# EAGLE schematic dc-driver (EAGLE 6.6.0)
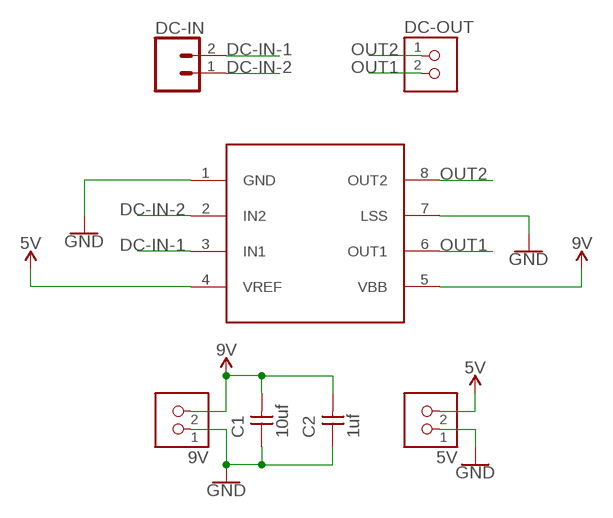
[diagram p0: schematic, sheet 1]

## Parts
5V  TERM-1X02-FABLAB  [ED555DS-2DS]
9V  TERM-1X02-FABLAB  [ED555DS-2DS]
C1  10uf  CAP-UNPOLARIZEDFAB  [C1206FAB]
C2  1uf  CAP-UNPOLARIZEDFAB  [C1206FAB]
DC-IN  CONN_021X02_NO_SILK  [1X02_NO_SILK]
DC-OUT  TERM-1X02-FABLAB  [ED555DS-2DS]
U$1  A4953  A4953-H-BRIDGE-MOTOR-DRIVER  [SOIC8]

## Nets
DC-IN-1: DC-IN.2 U$1.3(IN1)
DC-IN-2: DC-IN.1 U$1.2(IN2)
GND: 5V.1 9V.1 C1.1 C2.1 U$1.1(GND) U$1.7(LSS)
OUT1: DC-OUT.2 U$1.6(OUT1)
OUT2: DC-OUT.1 U$1.8(OUT2)
VCC: 5V.2 U$1.4(VREF) ; supply symbol labelled 5V
VDD: 9V.2 C1.2 C2.2 U$1.5(VBB) ; supply symbol labelled 9V

## Library data of the parts
5V 9V DC-OUT = fab:TERM-1X02: 3.5mm terminal block, 2 positions ED555-2DS as found in the fablab inventory. Stolen from Adafruit <http://www.ladyada.net/library/pcb/eaglelibrary.html>, adapted by Zaerc.
C1 C2 = fab:CAP-UNPOLARIZED
DC-IN = SparkFun-Connectors:CONN_02: Multi connection point. Often used as Generic Header-pin footprint for 0.1 inch spaced/style header connections On any of the 0.1 inch spaced packages, you can populate with these: Break Away Headers - Straight <https://www.sparkfun.com/products/116> (PRT-00116) Break Away Male Headers - Right Angle <https://www.sparkfun.com/products/553> (PRT-00553) Female Headers <https://www.sparkfun.com/products/115> (PRT-00115) Break Away Headers - Machine Pin <https://www.sparkfun.com/products/117> (PRT-00117) Break Away Female Headers - Swiss Machine Pin <https://www.sparkfun.com/products/743> (PRT-00743) For SCREWTERMINALS and SPRING TERMINALS visit here: Screw Terimnals on SparkFun.com <https://www.sparkfun.com/search/results?term=Screw+Terminals> (5mm/3.5mm/2.54mm spacing) This device is also useful as a general connection point to wire up your design to another part of your project. Our various solder wires solder well into these plated through hole pads. Hook-Up Wire - Assortment (Stranded, 22 AWG) <https://www.sparkfun.com/products/11375> (PRT-11375) Hook-Up Wire - Assortment (Solid Core, 22 AWG) <https://www.sparkfun.com/products/11367> (PRT-11367) View the entire wire category on our website here <https://www.sparkfun.com/categories/141> Special notes: Molex polarized connector foot print use with: PRT-08233 with associated crimp pins and housings. 2.54_SCREWTERM for use with PRT-10571. 3.5mm Screw Terminal footprints for PRT-08084 5mm Screw Terminal footprints for use with PRT-08432
U$1 = fab:A4953-H-BRIDGE-MOTOR-DRIVER